# Altium schematic sheet REUN.941613.001_Coagulator_Block_E4.SchDoc: Блок диодного лазерного
size 209 x 297 mm; Date: 10.06.22; ApprovedBy: Шавликов; CheckedBy: Шавликов; DrawnBy: Подлесный; DocumentNumber: РЕУН.941613.001 Э4 2D; SheetTotal: 1; PageSetup: Record=PageOptions|CenterHorizontal=True|CenterVertical=True|PrintScale=0.94|XCorrection=1.00|YCorrection=1.00|PrintKind=2|BorderSize=5000000|LeftOffset=0|BottomOffset=0|Orientation=1|PaperLength=2970|PaperWidth=2100|Scale=100|PaperSource=7|PrintQuality=600|MediaType=1|DitherType=10|PaperKind=A4|PrintScaleMode=1; Title1str: 2-х волнового коагулятора; DocumentType: Схема электрическая соединений; Format: A4; ImagePath: РЕУН.941613.001 ТЭ
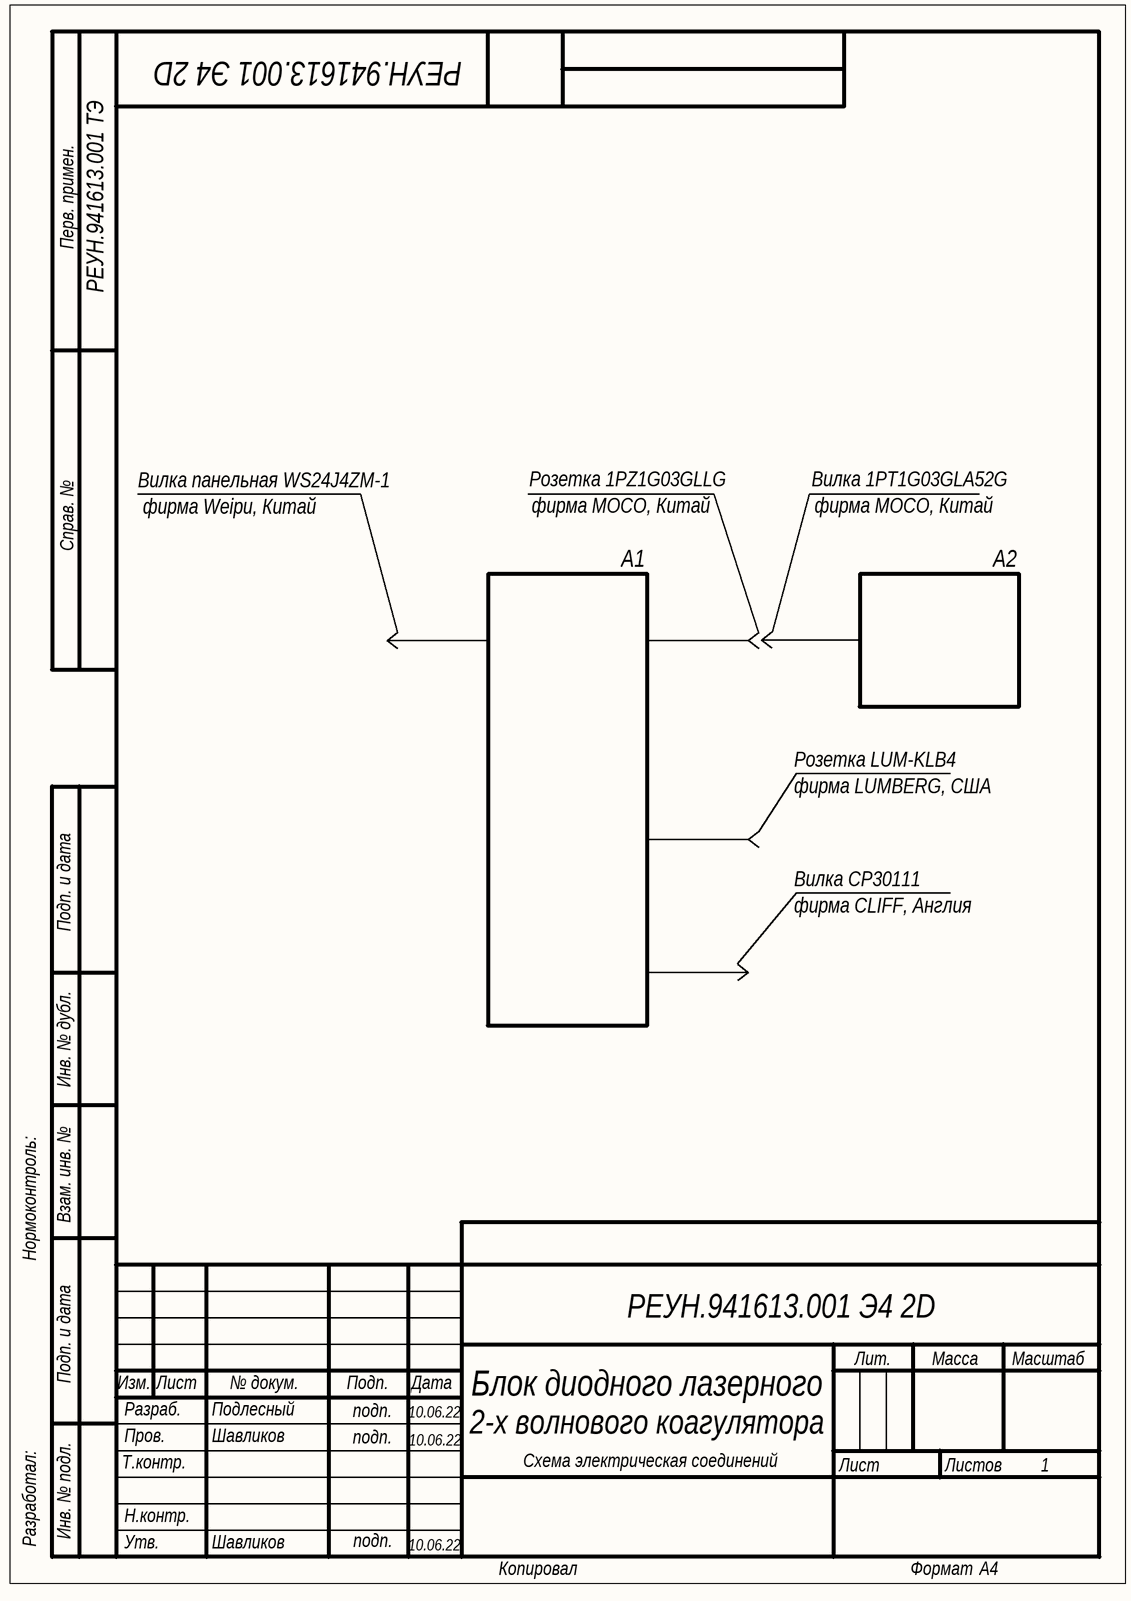
[diagram p0: REUN.941613.001_Coagulator_Block_E4.SchDoc]

## Notes on the sheet
- Перв. примен.
- Справ. №
- Вилка панельная WS24J4ZM-1
- фирма Weipu, Китай
- Розетка 1PZ1G03GLLG
- фирма MOCO, Китай
- Вилка 1PT1G03GLA52G
- A1
- A2
- Розетка LUM-KLB4
- фирма LUMBERG, США
- Подп. и дата
- Вилка CP30111
- фирма CLIFF, Aнглия
- Инв. № дубл.
- Нормоконтроль:
- Взам. инв. №
- Изм.
- Лист
- № докум.
- Подп.
- Дата
- Лит.
- Масса
- Масштаб
- Т.контр.
- Пров.
- Разраб.
- подп.
- Лиcт
- Листов
- Разработал:
- Инв. № подл.
- Н.контр.
- Утв.
- Копировал
- Формат